# EAGLE schematic 04B-355 (EAGLE 9.6.2)
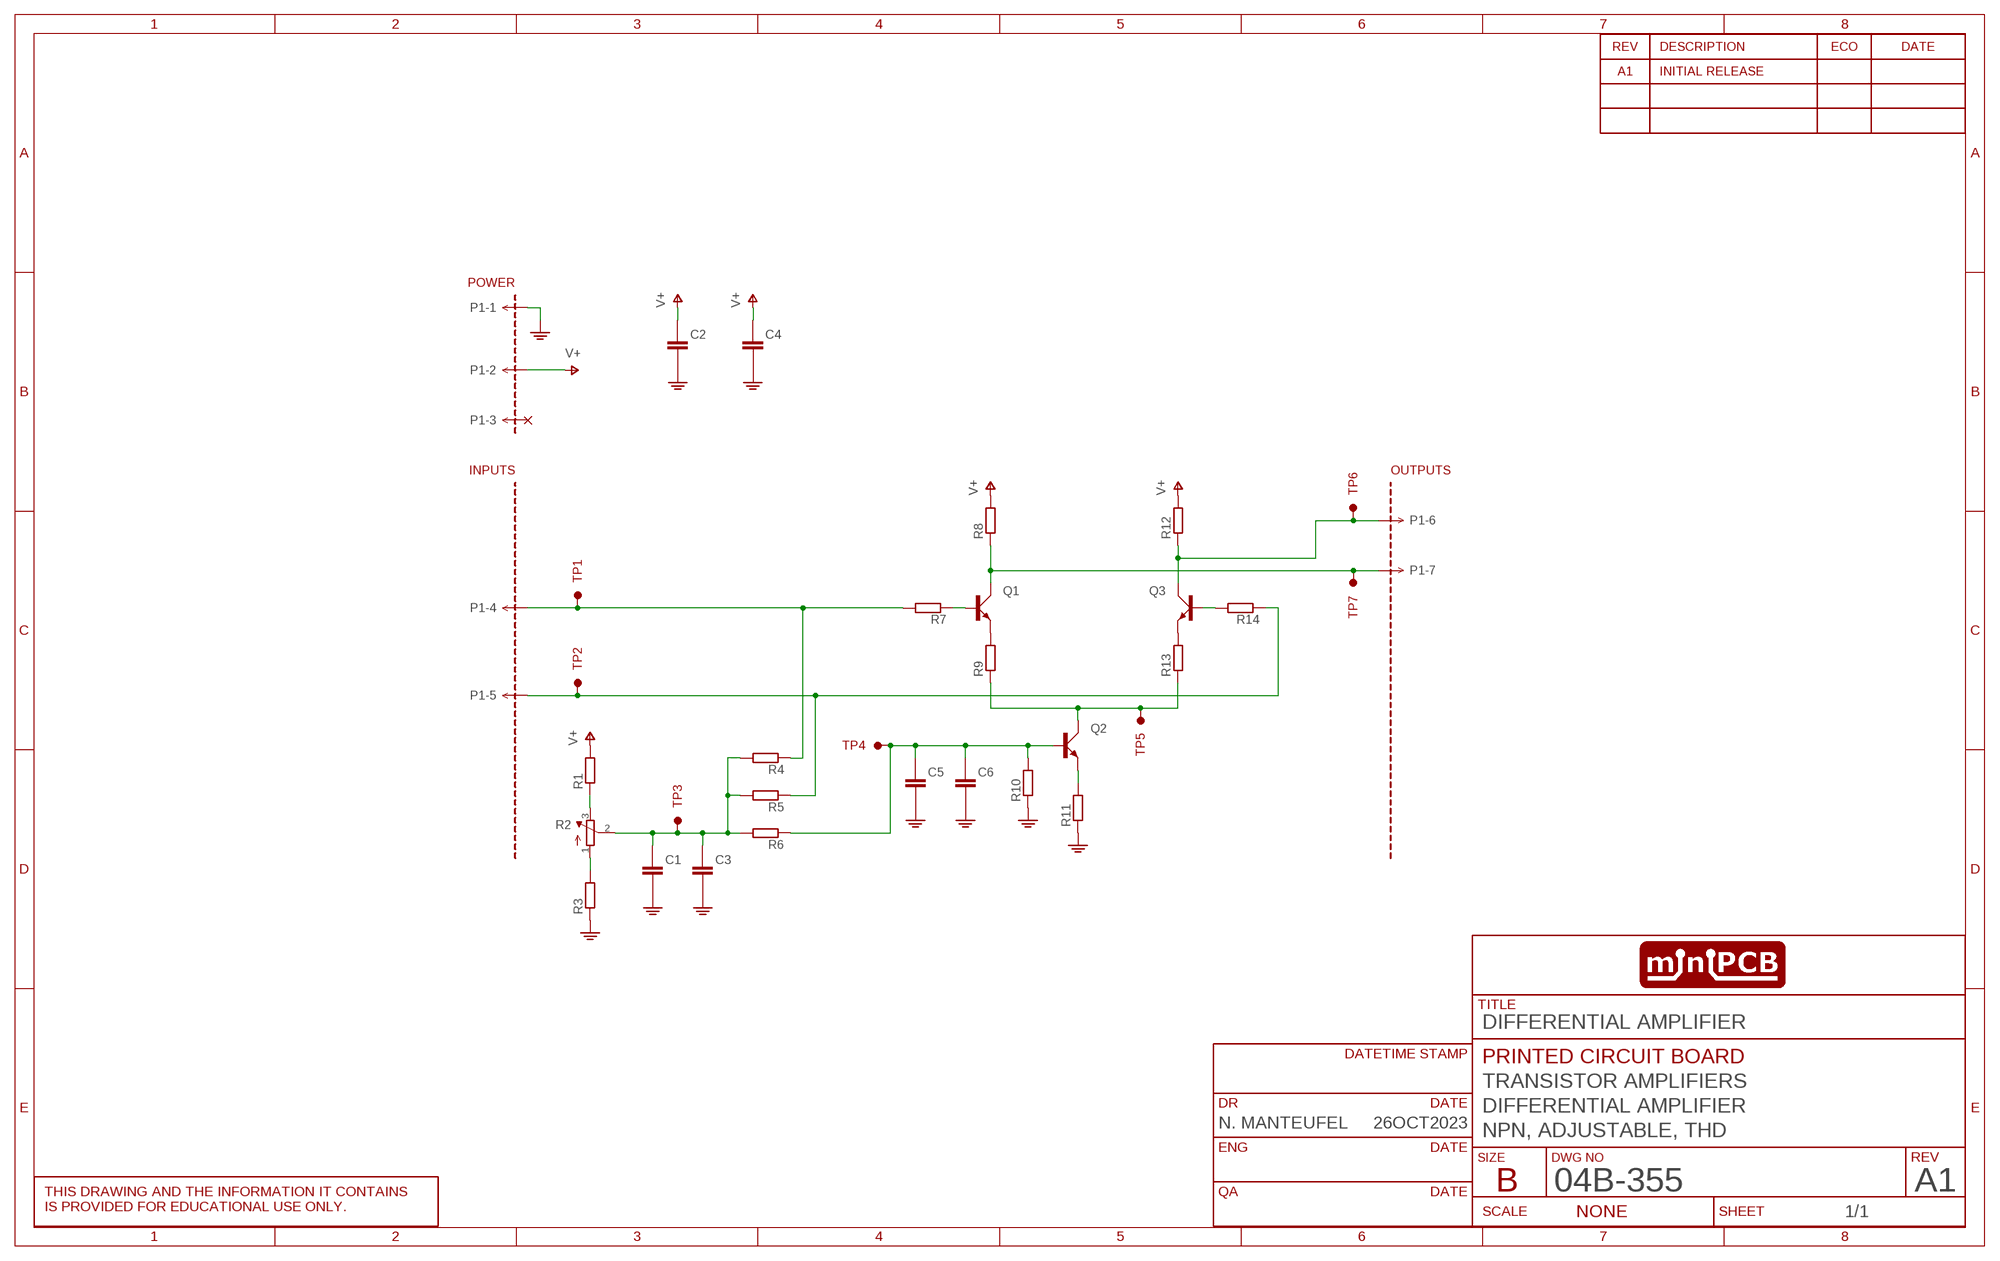
[diagram p0: schematic, sheet 1]
SHEET1 (SCHEMATIC): CIRCUIT_CATEGORY: TRANSISTOR AMPLIFIERS; CIRCUIT_NAME: DIFFERENTIAL AMPLIFIER; CIRCUIT_VARIANT: NPN, ADJUSTABLE, THD; DR: N. MANTEUFEL; DR_DATE: 26OCT2023; PCB_PCBA: PRINTED CIRCUIT BOARD; REVA: A1; REVISION: A1; TITLE: DIFFERENTIAL AMPLIFIER

## Parts
C1  CAPACITORTHD  [C050-024X044]
C2  CAPACITORTHD  [C050-024X044]
C3  CAPACITOR_10  [C5MM]
C4  CAPACITOR_10  [C5MM]
C5  CAPACITORTHD  [C050-024X044]
C6  CAPACITOR_10  [C5MM]
P1  MINIPCB_7P  [PINS_1X7]
PCB1  MINIPCB_0P50X75  [MINIPCB_0P_50X75]
Q1  BJT_NPNEBC  [TO92-EBC-OVAL]
Q2  BJT_NPNEBC  [TO92-EBC-OVAL]
Q3  BJT_NPNEBC  [TO92-EBC-OVAL]
R1  RESISTORTHD  [0204/10]
R2  TRIMPOT0.100THD  [TRIM_0100]
R3  RESISTORTHD  [0204/10]
R4  RESISTORTHD  [0204/10]
R5  RESISTORTHD  [0204/10]
R6  RESISTORTHD  [0204/10]
R7  RESISTORTHD  [0204/10]
R8  RESISTORTHD  [0204/10]
R9  RESISTORTHD  [0204/10]
R10  RESISTORTHD  [0204/10]
R11  RESISTORTHD  [0204/10]
R12  RESISTORTHD  [0204/10]
R13  RESISTORTHD  [0204/10]
R14  RESISTORTHD  [0204/10]
TP1  TESTPOINTKE5000-SMTEXT  [PINS_1_TESTPOINT_KE5000_NOTEXT]
TP2  TESTPOINTKE5000-SMTEXT  [PINS_1_TESTPOINT_KE5000_NOTEXT]
TP3  TESTPOINTKE5000-SMTEXT  [PINS_1_TESTPOINT_KE5000_NOTEXT]
TP4  TESTPOINTKE5000-SMTEXT  [PINS_1_TESTPOINT_KE5000_NOTEXT]
TP5  TESTPOINTKE5000-SMTEXT  [PINS_1_TESTPOINT_KE5000_NOTEXT]
TP6  TESTPOINTKE5000-SMTEXT  [PINS_1_TESTPOINT_KE5000_NOTEXT]
TP7  TESTPOINTKE5000-SMTEXT  [PINS_1_TESTPOINT_KE5000_NOTEXT]

## Nets
GND: C1.2(-) C2.2(-) C3.- C4.- C5.2(-) C6.- P1.1 R3.1 R10.1 R11.1
N$1: Q2.E R11.2
N$2: Q1.E R9.2
N$3: P1.7 Q1.C R8.1 TP7.1
N$4: P1.6 Q3.C R12.1 TP6.1
N$5: Q3.E R13.2
N$6: Q2.C R9.1 R13.1 TP5.1
N$7: R1.1 R2.3(E)
N$8: P1.4 R4.1 R7.2 TP1.1
N$9: P1.5 R5.1 R14.1 TP2.1
N$10: Q3.B R14.2
N$11: Q1.B R7.1
N$12: C5.1(+) C6.+ Q2.B R6.1 R10.2 TP4.1
N$13: R2.1(A) R3.2
N$14: C1.1(+) C3.+ R2.2(S) R4.2 R5.2 R6.2 TP3.1
V+: C2.1(+) C4.+ P1.2 R1.2 R8.2 R12.2
Unconnected: P1.3

## Library data of the parts
C1-C6 = minipcb:CAPACITOR
P1 = minipcb:MINIPCB_7P
PCB1 = minipcb:MINIPCB_0P; CIRCUIT_CATEGORY: CIRCUIT CATEGORY; REVISION: A1; TITLE: TITLE
Q1-Q3 = minipcb:BJT_NPN: TRANSISTOR
R1 R3-R14 = minipcb:RESISTOR
R2 = minipcb:TRIMPOT: SMT trimmer potentiometer part number TC33X http://www.ladyada.net/library/eagle
TP1-TP7 = minipcb:TESTPOINT